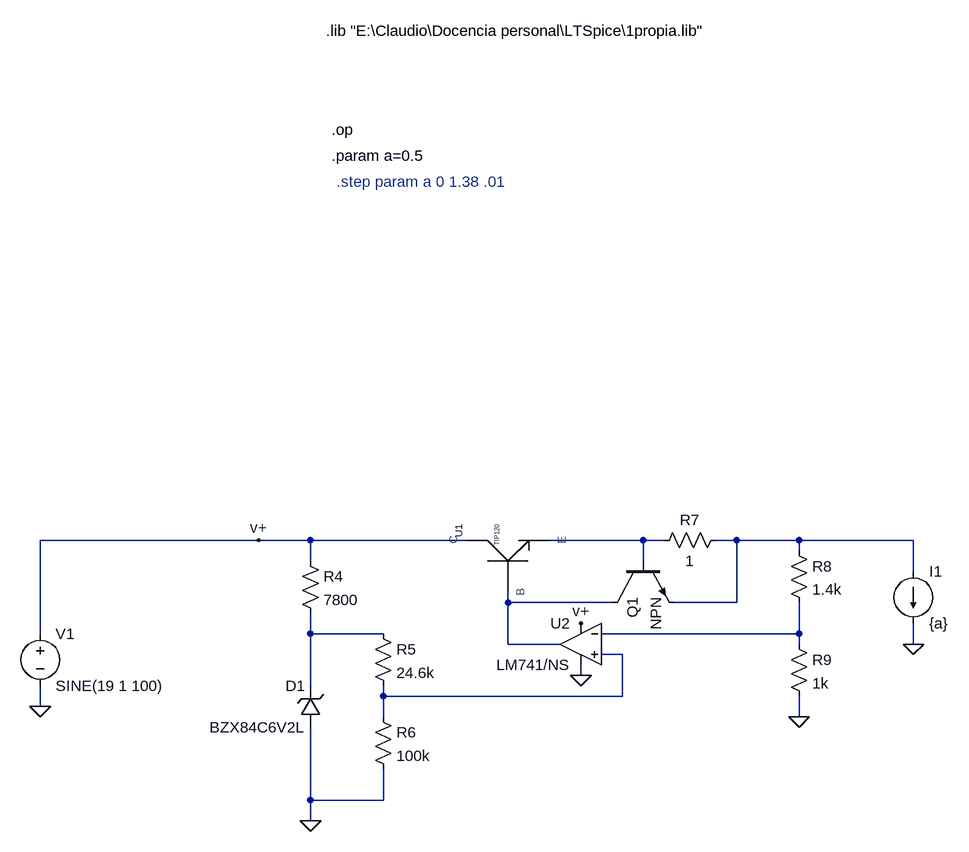
[diagram p0: schematic fuente basica 2.asc]
fuente basica 2.asc, the LTspice schematic file:
Version 4
SHEET 1 1284 680
WIRE 208 224 -128 224
WIRE 288 224 208 224
WIRE 528 224 288 224
WIRE 800 224 656 224
WIRE 832 224 800 224
WIRE 944 224 912 224
WIRE 1040 224 944 224
WIRE 1216 224 1040 224
WIRE 1040 240 1040 224
WIRE 288 256 288 224
WIRE 800 256 800 224
WIRE 1216 272 1216 224
WIRE 592 320 592 304
WIRE 752 320 592 320
WIRE 944 320 944 224
WIRE 944 320 848 320
WIRE -128 368 -128 224
WIRE 288 368 288 336
WIRE 400 368 288 368
WIRE 1040 368 1040 320
WIRE 1040 368 736 368
WIRE 592 384 592 320
WIRE 672 384 592 384
WIRE 1040 384 1040 368
WIRE 1216 384 1216 352
WIRE 768 400 736 400
WIRE 704 432 704 416
WIRE 288 448 288 368
WIRE 400 464 400 448
WIRE 768 464 768 400
WIRE 768 464 400 464
WIRE -128 480 -128 448
WIRE 400 496 400 464
WIRE 1040 496 1040 464
WIRE 288 624 288 512
WIRE 400 624 400 576
WIRE 400 624 288 624
WIRE 288 656 288 624
FLAG 704 432 0
FLAG 704 352 v+
FLAG 208 224 v+
FLAG 288 656 0
FLAG 1040 496 0
FLAG 1216 384 0
FLAG -128 480 0
DATAFLAG 1168 224 ""
DATAFLAG 352 224 ""
DATAFLAG 736 224 ""
SYMBOL Propia\\Darlington\ npn 592 256 R270
SYMATTR Value TIP120
SYMATTR InstName U1
SYMBOL res 272 240 R0
SYMATTR InstName R4
SYMATTR Value 7800
SYMBOL res 384 352 R0
SYMATTR InstName R5
SYMATTR Value 24.6k
SYMBOL res 384 480 R0
SYMATTR InstName R6
SYMATTR Value 100k
SYMBOL zener 304 512 R180
WINDOW 0 24 64 Left 2
WINDOW 3 24 0 Left 2
SYMATTR InstName D1
SYMATTR Value BZX84C6V2L
SYMBOL OpAmps\\opamp2 704 320 M0
SYMATTR InstName U2
SYMATTR Value LM741/NS
SYMBOL res 928 208 R90
WINDOW 0 0 56 VBottom 2
WINDOW 3 32 56 VTop 2
SYMATTR InstName R7
SYMATTR Value 1
SYMBOL npn 752 256 M90
SYMATTR InstName Q1
SYMBOL res 1024 224 R0
SYMATTR InstName R8
SYMATTR Value 1.4k
SYMBOL res 1024 368 R0
SYMATTR InstName R9
SYMATTR Value 1k
SYMBOL current 1216 272 R0
WINDOW 123 0 0 Left 0
WINDOW 39 0 0 Left 0
SYMATTR InstName I1
SYMATTR Value {a}
SYMBOL voltage -128 352 R0
WINDOW 123 0 0 Left 0
WINDOW 39 0 0 Left 0
SYMATTR InstName V1
SYMATTR Value SINE(19 1 100)
TEXT 312 -560 Left 2 !.lib "E:\\Claudio\\Docencia personal\\LTSpice\\1propia.lib"
TEXT 320 -408 Left 2 !.op
TEXT 320 -368 Left 2 !.param a=0.5
TEXT 328 -328 Left 2 ;.step param a 0 1.38 .01

The netlist it stands for:
* fuente basica 2.asc
XU1 v+ N003 N001 TIP120  ; pins C B E
R4 v+ N004 7800
R5 N004 N006 24.6k
R6 N006 0 100k
D1 0 N004 BZX84C6V2L
XU2 N006 N005 v+ 0 N003 LM741/NS  ; pins In+ In- V+ V- OUT
R7 N002 N001 1
Q1 N003 N001 N002 0 NPN
R8 N002 N005 1.4k
R9 N005 0 1k
I1 N002 0 {a}
V1 v+ 0 SINE(19 1 100)
.model D D
.lib standard.dio
.model NPN NPN
.model PNP PNP
.lib standard.bjt
.lib "E:\Claudio\Docencia personal\LTSpice\1propia.lib"
.op
.param a=0.5
* .step param a 0 1.38 .01
.backanno
.end